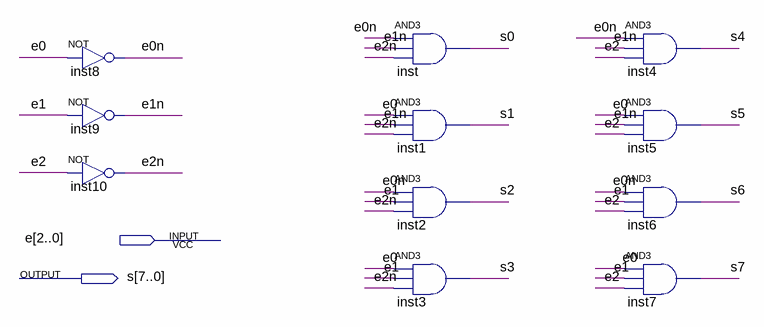
[diagram p0: schematic sheet]
// Quartus schematic bfs_decod_3x8.bdf as structural Verilog: 11 symbols, 2 pins
module bfs_decod_3x8 (
  input  [2:0] e,
  output [7:0] s
);

  wire e0n, e1n, e2n;

  not inst8 (e0n, e[0]);
  not inst9 (e1n, e[1]);
  not inst10 (e2n, e[2]);
  and inst (s[0], e0n, e1n, e2n);
  and inst1 (s[1], e[0], e1n, e2n);
  and inst2 (s[2], e0n, e[1], e2n);
  and inst3 (s[3], e[0], e[1], e2n);
  and inst4 (s[4], e0n, e1n, e[2]);
  and inst5 (s[5], e[0], e1n, e[2]);
  and inst6 (s[6], e0n, e[1], e[2]);
  and inst7 (s[7], e[0], e[1], e[2]);
endmodule
